# Altium schematic sheet OC_PROT.SchDoc
size C; SheetNumber: 2; SheetTotal: 10
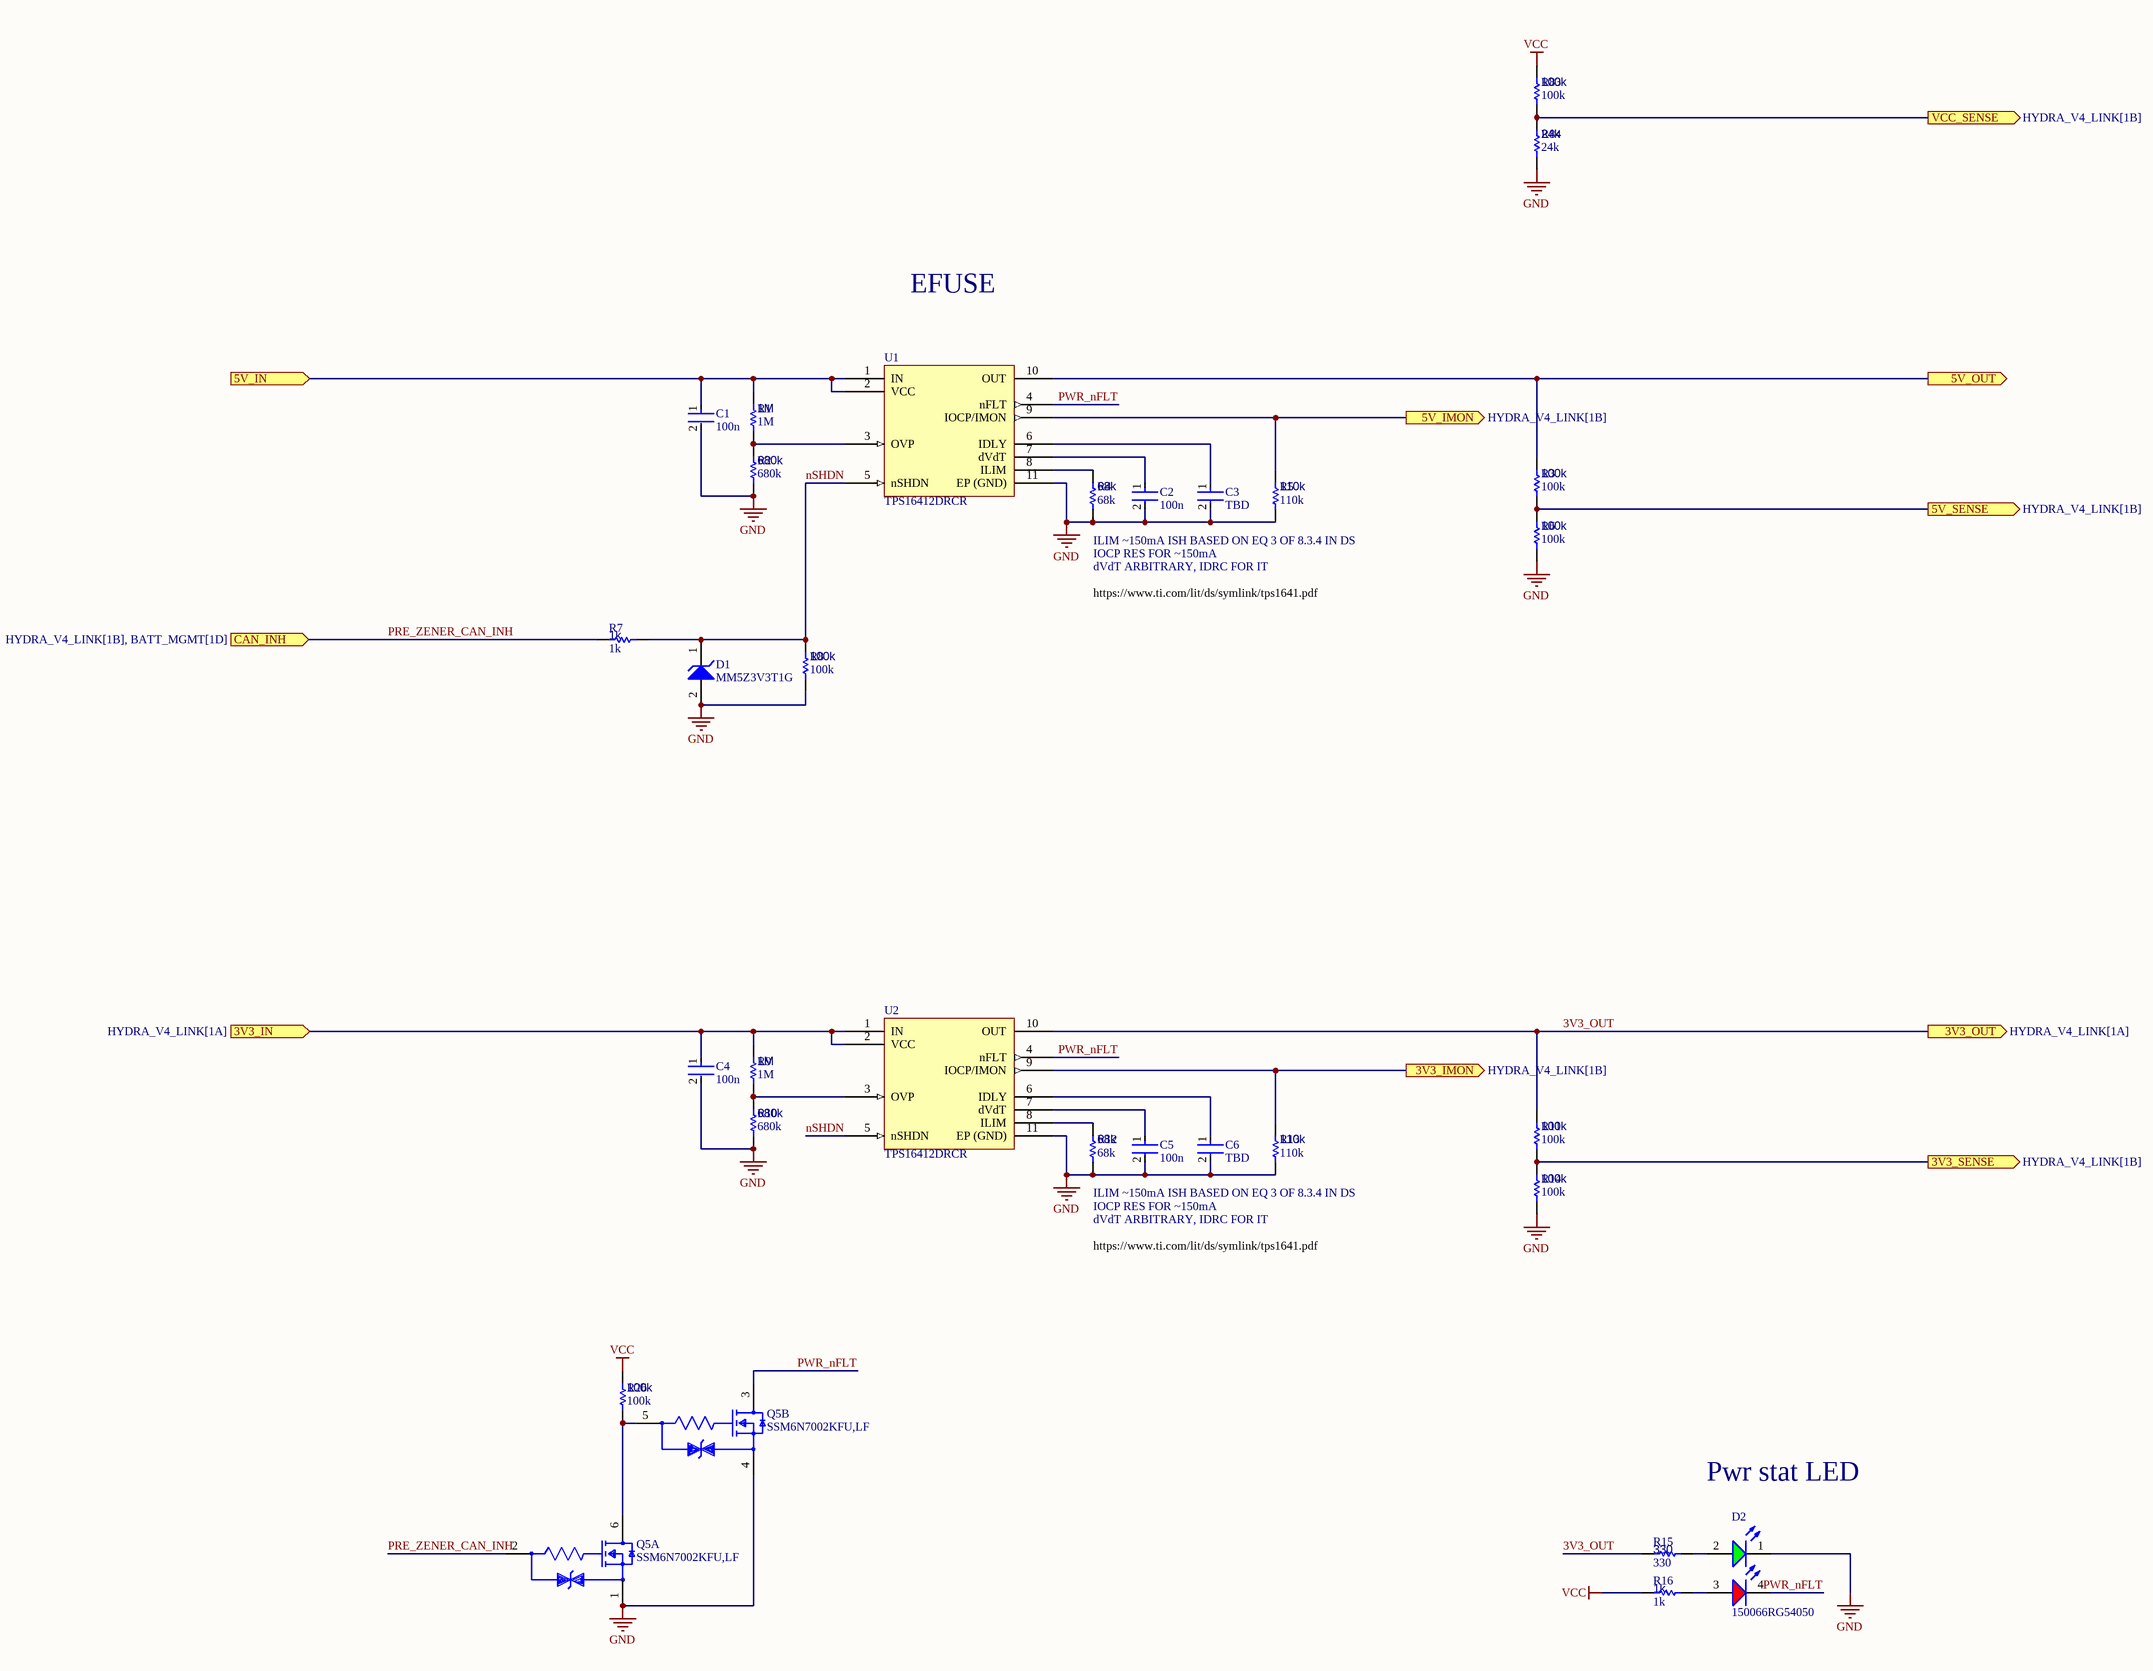
[diagram p0: OC_PROT.SchDoc]

## Parts
C1  100n  [FP-0402-L_1_0_0_05-W_0_5-IPC_A]
C2  100n  [FP-0402-L_1_0_0_05-W_0_5-IPC_A]
C3  TBD  [FP-0402-L_1_0_0_05-W_0_5-IPC_A]
C4  100n  [FP-0402-L_1_0_0_05-W_0_5-IPC_A]
C5  100n  [FP-0402-L_1_0_0_05-W_0_5-IPC_A]
C6  TBD  [FP-0402-L_1_0_0_05-W_0_5-IPC_A]
D1  MM5Z3V3T1G  [ONSC-SOD-523-2-502-01_V]
D2  150066RG54050  [WL-SBCD_0606]
Q5  SSM6N7002KFU,LF  [FP-SSOP6-P-0_65A-MFG]  (parts A,B of 2)
R1  1M  [R0603B]
R2  680k  [R0603B]
R3  100k  [R0603B]
R4  68k  [R0603B]
R5  110k  [R0603B]
R6  100k  [R0603B]
R7  1k  [R0603B]
R8  100k  [R0603B]
R9  1M  [R0603B]
R10  680k  [R0603B]
R11  100k  [R0603B]
R12  68k  [R0603B]
R13  110k  [R0603B]
R14  100k  [R0603B]
R15  330  [R0603B]
R16  1k  [R0603B]
R26  100k  [R0603B]
R83  100k  [R0603B]
R84  24k  [R0603B]
U1  TPS16412DRCR  [PSON50P300X100_HS-11N]
U2  TPS16412DRCR  [PSON50P300X100_HS-11N]

## Ports
3V3_IMON (out, see HYDRA_V4_LINK[1B]), 3V3_IN (in, see HYDRA_V4_LINK[1A]), 3V3_OUT (out, see HYDRA_V4_LINK[1A]), 3V3_SENSE (out, see HYDRA_V4_LINK[1B]), 5V_IMON (out, see HYDRA_V4_LINK[1B]), 5V_IN (in, see HYDRA_V4_LINK[1A]), 5V_OUT (out, see HYDRA_V4_LINK[1A]), 5V_SENSE (out, see HYDRA_V4_LINK[1B]), CAN_INH (in, see HYDRA_V4_LINK[1B], BATT_MGMT[1D]), VCC_SENSE (out, see HYDRA_V4_LINK[1B])

## Nets
GND: C1.2 C2.2 C3.2 C4.2 C5.2 C6.2 D1.2(A) D2.1(K) Q5.1(Source1) Q5.4(Source2) R2.2 R4.2 R5.2 R6.1 R8.1 R10.2 R12.2 R13.2 R14.1 R84.1 U1.11(EP_(GND)) U2.11(EP_(GND))
VCC: R16.1 R26.1 R83.2
3V3_IMON: R13.1 U2.9(IOCP/IMON) ; port 3V3_IMON
3V3_IN: C4.1 R9.1 U2.1(IN) U2.2(VCC) ; port 3V3_IN
3V3_OUT: R11.2 R15.1 U2.10(OUT) ; port 3V3_OUT
3V3_SENSE: R11.1 R14.2 ; port 3V3_SENSE
5V_IMON: R5.1 U1.9(IOCP/IMON) ; port 5V_IMON
5V_IN: C1.1 R1.1 U1.1(IN) U1.2(VCC) ; port 5V_IN
5V_OUT: R3.2 U1.10(OUT) ; port 5V_OUT
5V_SENSE: R3.1 R6.2 ; port 5V_SENSE
nSHDN: D1.1(K) R7.1 R8.2 U1.5(nSHDN) U2.5(nSHDN)
PRE_ZENER_CAN_INH: Q5.2(Gate1) R7.2 ; port CAN_INH
PWR_nFLT: D2.4(K) Q5.3(Drain2) U1.4(nFLT) U2.4(nFLT)
VCC_SENSE: R83.1 R84.2 ; port VCC_SENSE
NetC2_1: C2.1 U1.7(dVdT)
NetC3_1: C3.1 U1.6(IDLY)
NetC5_1: C5.1 U2.7(dVdT)
NetC6_1: C6.1 U2.6(IDLY)
NetD2_2: D2.2(A) R15.2
NetD2_3: D2.3(A) R16.2
NetQ5_5: Q5.5(Gate2) Q5.6(Drain1) R26.2
NetR1_2: R1.2 R2.1 U1.3(OVP)
NetR4_1: R4.1 U1.8(ILIM)
NetR9_2: R9.2 R10.1 U2.3(OVP)
NetR12_1: R12.1 U2.8(ILIM)

## Notes on the sheet
- EFUSE
- ILIM ~150mA ISH BASED ON EQ 3 OF 8.3.4 IN DS
- dVdT ARBITRARY, IDRC FOR IT
- IOCP RES FOR ~150mA
- https://www.ti.com/lit/ds/symlink/tps1641.pdf
- Pwr stat LED

## Library data of the parts
C1-C6 = CMP-001-00058-1: LARGE PADS, 0402 CAP, CHANGE COMMENT TO MATCH REAL P/N; Capacitor Type: Ceramic; Min Operating Temperature: -55°C; Mounting Technology: Surface Mount; Pins: 2; Case/Package: 0402; RoHS Compliant: Yes; Max Operating Temperature: 85°C
  C1 C2 C4 C5: Value: 100n
  C3 C6: Value: TBD
D1 = CMP-1060-00750-1: Zener Voltage Regulator, 500 mW, 2-Pin SOD-523, Pb-Free, Tape and Reel; Manufacturer: On Semiconductor; P Max (W): 0.5; VZ Typ (V): 3.3; RoHS: Pb-Free; ComponentLink2Description: Datasheet; PackageReference: SOD-523-2-502-01; DatasheetVersion: Rev. 10; ComponentLink1Description: Manufacturer URL; PackageVersion: Rev. E, 09/2010; ComponentLink3URL: http://www.onsemi.com/pub_link/Collateral/502-01.PDF; ComponentLink2URL: http://www.onsemi.cn/pub_link/Collateral/MM5Z2V4T1-D.PDF; Mounting Technology: Surface Mount; PartNumber: MM5Z3V3T1G; Packing: Tape and Reel; PackageDescription: 2-Pin SOD, Body 1.2 x 0.8 mm; ComponentLink1URL: http://www.onsemi.com/; ComponentLink3Description: Package Specification
D2 = CMP-004-00040-2: Led, Red/Grn, 180Mcd/230Mcd, 624Nm/525Nm Rohs Compliant: Yes; Source: rgled.SchLib; Component Type: Standard; Design Item ID: CMP-004-00034-2; Pins: 4
Q5 = CMP-006-0005-1: Transistor MOSFET Array Dual N-CH 60V 300mA 6-Pin SOT-363 Emboss T/R; Max Power Dissipation: 285mW; Input Capacitance: 40pF; FET Type: 2 N-Channel; Rds On Max: 1.5R; Mounting Technology: Surface Mount; Continuous Drain Current (ID): 300mA; Drain to Source Voltage (Vdss): 60V; Packaging: Cut Tape; Series: -
R1-R16 R26 R83 R84 = CMP-009-00002-14: Resistor
  R1 R9: Value: 1M
  R2 R10: Value: 680k
  R3 R6 R8 R11 R14 R26 R83: Value: 100k
  R4 R12: Value: 68k
  R5 R13: Value: 110k
  R7 R16: Value: 1k
  R15: Value: 330
  R84: Value: 24k
U1 U2 = CMP-019-00048-3: 2.7-V to 40-V 152-mΩ 1.8-A eFuse with output power limiting 10-VSON -40 to 125